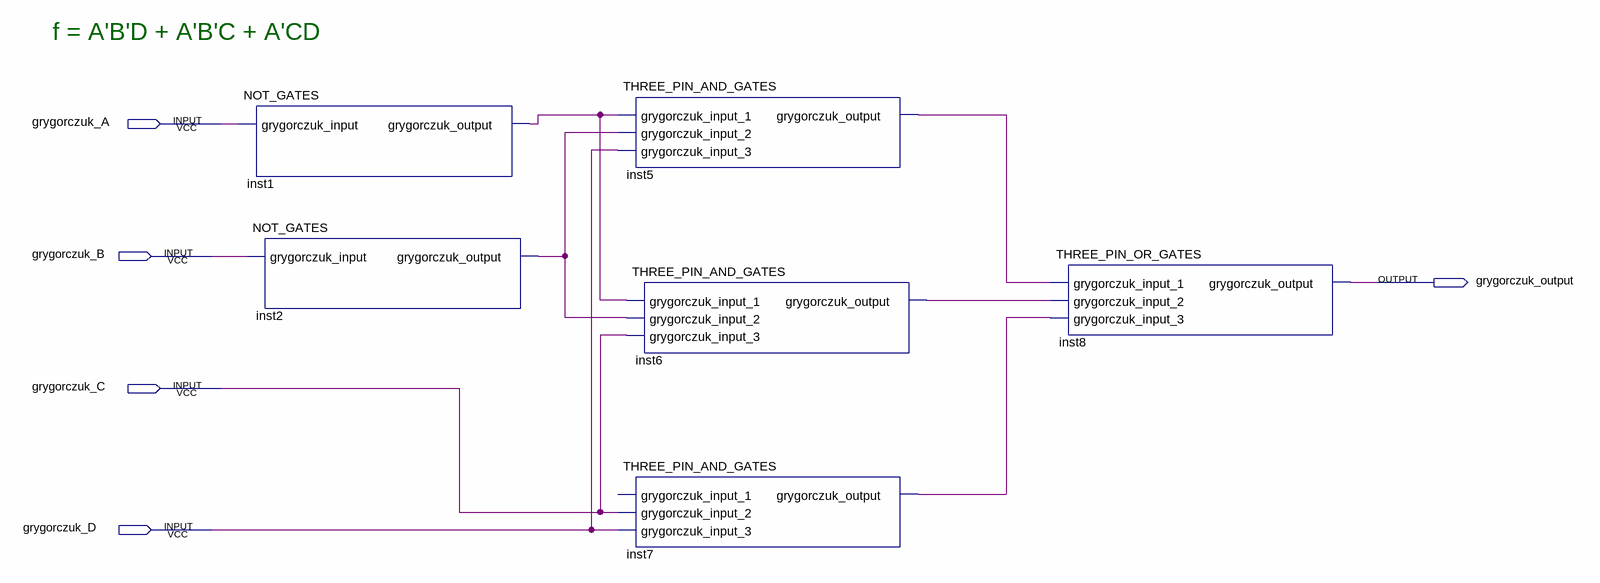
[diagram p0: schematic sheet]
// Quartus schematic SEVEN_SEGMENT_DISPLAY_NAND_F.bdf as structural Verilog: 6 symbols, 5 pins
module SEVEN_SEGMENT_DISPLAY_NAND_F (
  input  grygorczuk_A,
  input  grygorczuk_B,
  input  grygorczuk_C,
  input  grygorczuk_D,
  output grygorczuk_output
);

  wire inst1_grygorczuk_output, inst2_grygorczuk_output, inst5_grygorczuk_output, inst6_grygorczuk_output,
       inst7_grygorczuk_output;

  NOT_GATES inst1 (.grygorczuk_input(grygorczuk_A), .grygorczuk_output(inst1_grygorczuk_output));
  NOT_GATES inst2 (.grygorczuk_input(grygorczuk_B), .grygorczuk_output(inst2_grygorczuk_output));
  THREE_PIN_AND_GATES inst5 (
    .grygorczuk_input_1(inst1_grygorczuk_output), .grygorczuk_input_2(inst2_grygorczuk_output),
    .grygorczuk_input_3(grygorczuk_D), .grygorczuk_output(inst5_grygorczuk_output));
  THREE_PIN_AND_GATES inst6 (
    .grygorczuk_input_1(inst1_grygorczuk_output), .grygorczuk_input_2(inst2_grygorczuk_output),
    .grygorczuk_input_3(grygorczuk_C), .grygorczuk_output(inst6_grygorczuk_output));
  THREE_PIN_AND_GATES inst7 (
    .grygorczuk_input_2(grygorczuk_C), .grygorczuk_input_3(grygorczuk_D),
    .grygorczuk_output(inst7_grygorczuk_output));  // open: grygorczuk_input_1
  THREE_PIN_OR_GATES inst8 (
    .grygorczuk_input_1(inst5_grygorczuk_output), .grygorczuk_input_2(inst6_grygorczuk_output),
    .grygorczuk_input_3(inst7_grygorczuk_output), .grygorczuk_output(grygorczuk_output));

  // Notes on the sheet:
  //   f = A'B'D + A'B'C + A'CD
endmodule
